# EAGLE design wander-compass-upside-down (EAGLE 9.3.2)
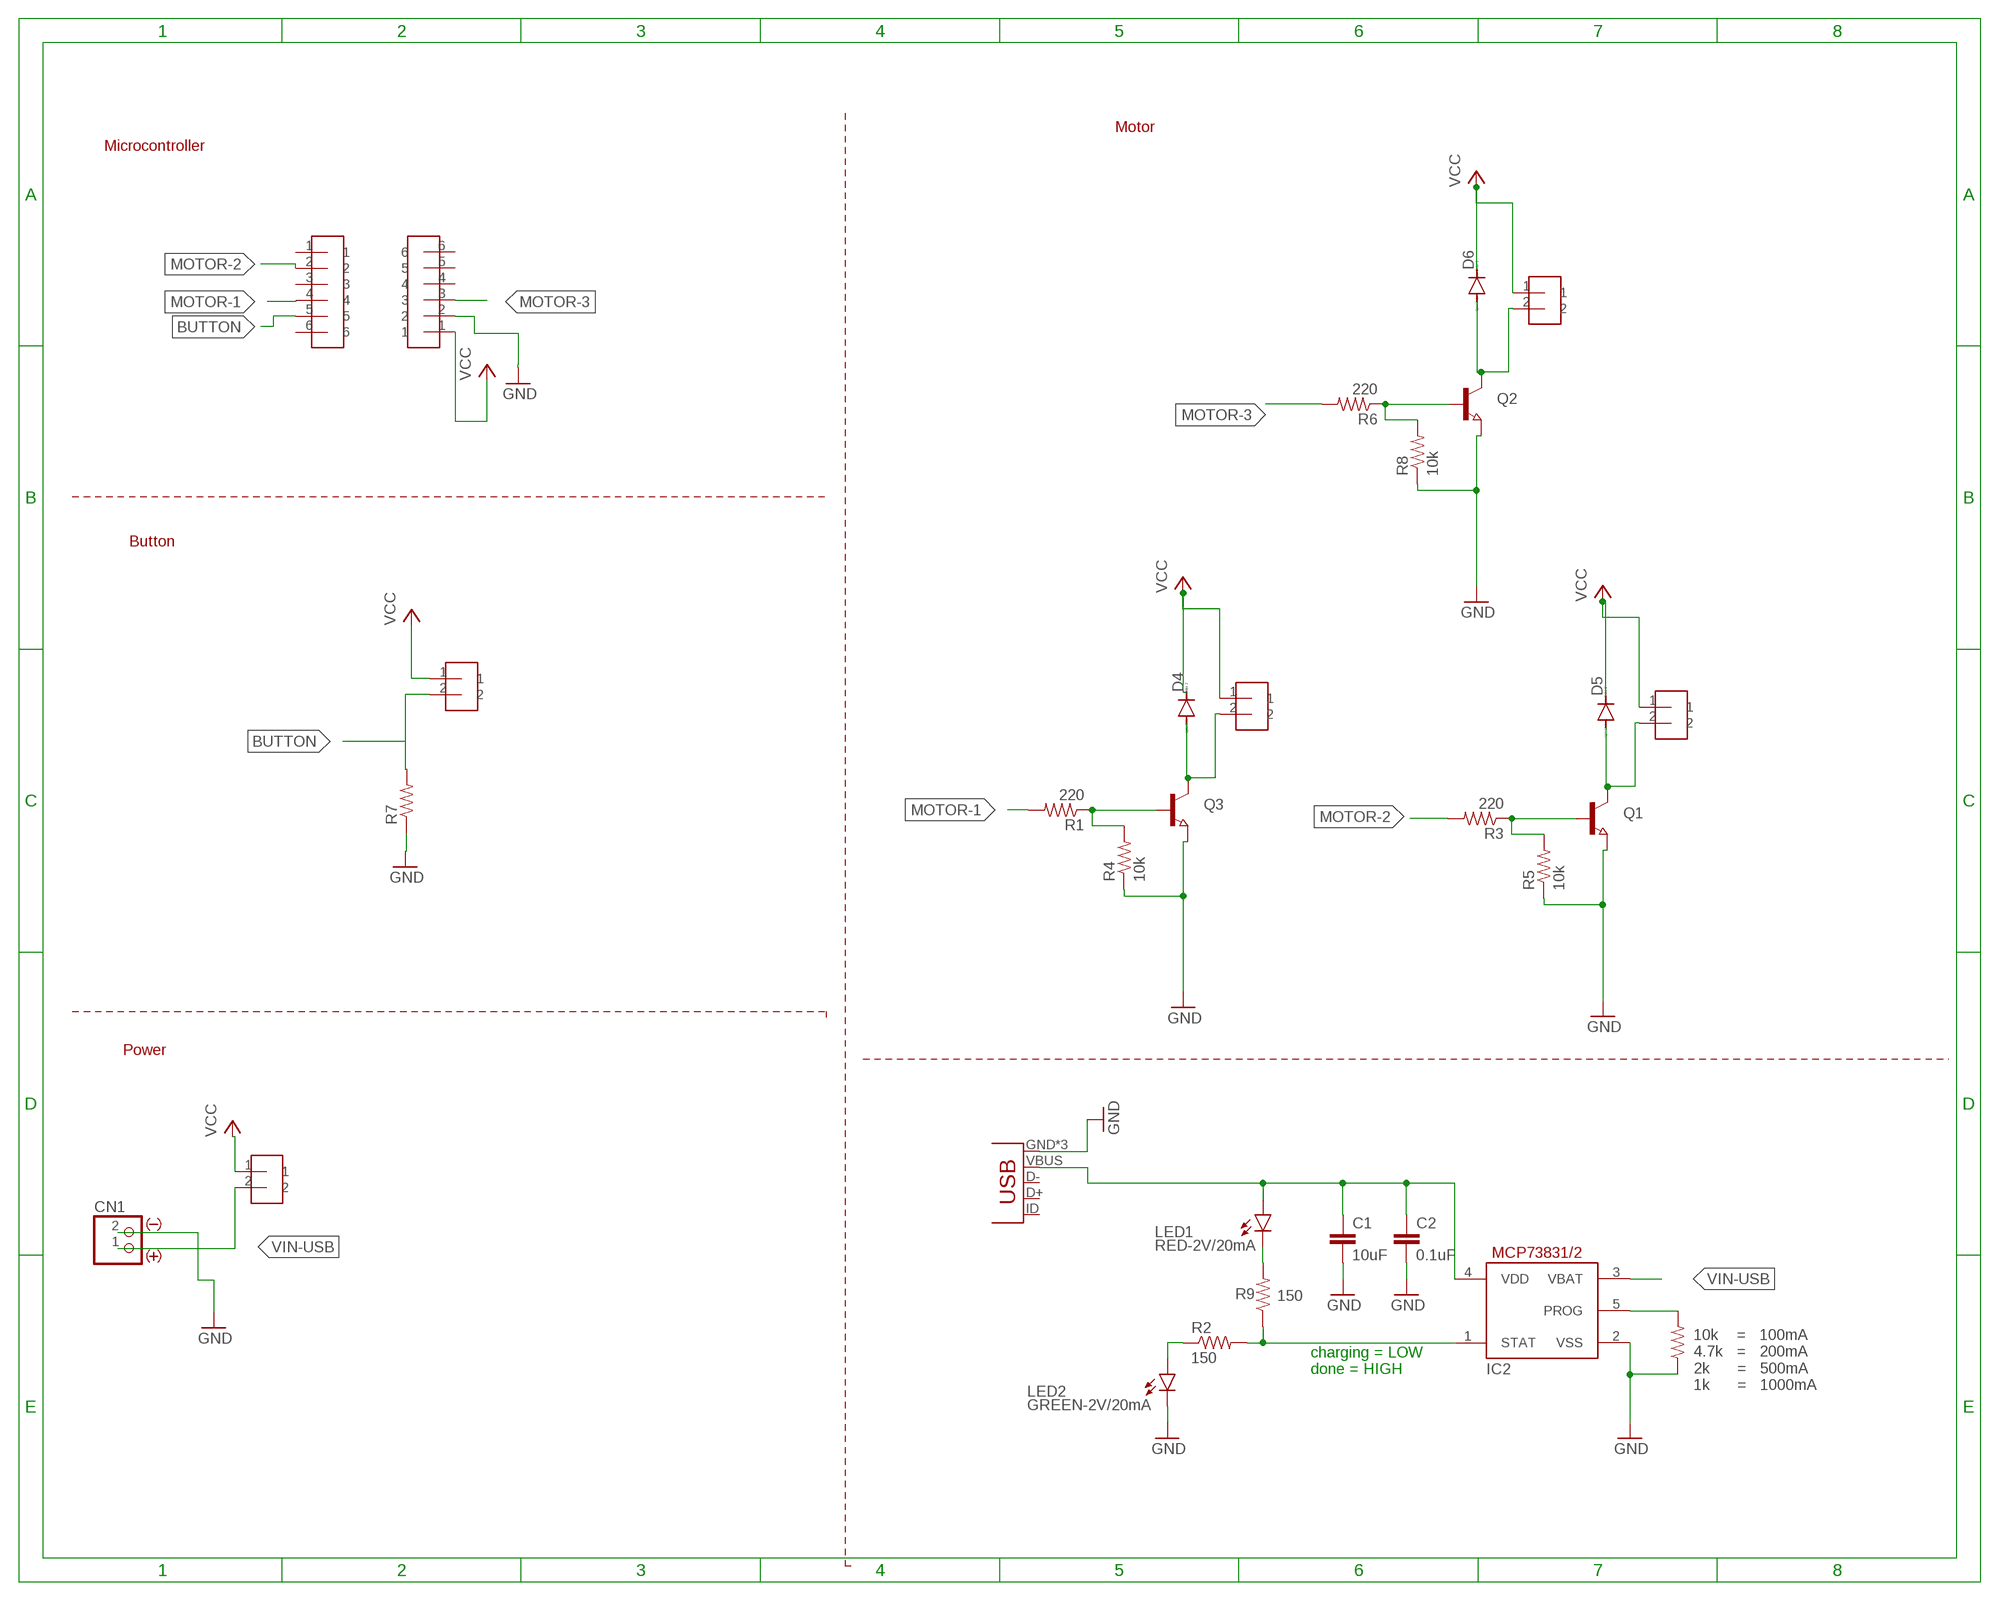
[diagram p0: schematic, sheet 1]

## Parts
C1  10uF  CAP-0805  [0805]
C2  0.1uF  CAP-0805  [0805]
CN1  JST_2PIN_BATTERY-SMT-HORIZ  [JST-PH-2-SMT-RA]
D4  DIODE-SOD523  [SOD523]
D5  DIODE-SOD523  [SOD523]
D6  DIODE-SOD523  [SOD523]
IC2  LIPO_CHARGER/OT  [SOT23-5L]
JP1  USB_CONN-10118192-0001LF  [USB-MICROB]
LED1  RED-2V/20mA  LED-0805  [CHIP-LED0805]
LED2  GREEN-2V/20mA  LED-0805  [CHIP-LED0805]
MOTOR-CENTER-HEADER  HEADER-2  [HEADER-2]
MOTOR-RIGHT-HEADER  HEADER-2  [HEADER-2]
MOTOR_LEFT_HEADER  HEADER-2  [HEADER-2]
Q1  TRANSISTOR-NPN-SOT23  [SOT23]
Q2  TRANSISTOR-NPN-SOT23  [SOT23]
Q3  TRANSISTOR-NPN-SOT23  [SOT23]
R1  220  RESISTOR0603  [0603-RES]
R2  150  RESISTOR-0805  [0805]
R3  220  RESISTOR0603  [0603-RES]
R4  10k  RESISTOR0603  [0603-RES]
R5  10k  RESISTOR0603  [0603-RES]
R6  220  RESISTOR0603  [0603-RES]
R7  RESISTOR0603  [0603-RES]
R8  10k  RESISTOR0603  [0603-RES]
R9  150  RESISTOR-0805  [0805]
R10  2k  RESISTOR-0805  [0805]
U$1  HEADER-2  [HEADER-2]
U$5  HEADER-6  [HEADER-6]
U$6  HEADER-6  [HEADER-6]
U$7  HEADER-2  [HEADER-2]

## Nets
5V: C1.1 C2.1 IC2.4(VDD) JP1.VBUS LED1.A
BUTTON: R7.2 U$1.2 U$6.5
CURRENT-CONTROL: IC2.5(PROG) R10.2
GND: C1.2 C2.2 CN1.2 IC2.2(VSS) JP1.GND JP1.MT1(GND) JP1.MT2(GND) LED2.C Q1.2(E) Q2.2(E) Q3.2(E) R4.1 R5.1 R7.1 R8.1 R10.1 U$5.2
MOTOR-1: R1.2 U$6.4
MOTOR-2: R3.2 U$6.2
MOTOR-3: R6.2 U$5.3
N$1: D4.A MOTOR_LEFT_HEADER.2 Q3.3(C)
N$2: Q1.1(B) R3.1 R5.2
N$3: D5.A MOTOR-CENTER-HEADER.2 Q1.3(C)
N$4: Q3.1(B) R1.1 R4.2
N$5: Q2.1(B) R6.1 R8.2
N$6: D6.A MOTOR-RIGHT-HEADER.2 Q2.3(C)
N$8: LED1.C R9.2
N$9: LED2.A R2.1
STATUS: IC2.1(STAT) R2.2 R9.1
VCC: D4.C D5.C D6.C MOTOR-CENTER-HEADER.1 MOTOR-RIGHT-HEADER.1 MOTOR_LEFT_HEADER.1 U$1.1 U$5.1 U$7.1
VIN-USB: CN1.1 IC2.3(VBAT) U$7.2
Unconnected: JP1.D+ JP1.D- JP1.ID(SHIELD) U$5.4 U$5.5 U$5.6 U$6.1 U$6.3 U$6.6

## Notes on the sheet
- Motor
- Microcontroller
- Button
- Power
- charging = LOW
  done = HIGH
- 10k    =   100mA
  4.7k   =   200mA
  2k      =   500mA
  1k      =   1000mA

## Library data of the parts
C1 C2 = homemade-hardware:CAP: Capacitor Standard 0603 ceramic capacitor, and 0.1" leaded capacitor.
CN1 = homemade-hardware:JST_2PIN_BATTERY: JST 2-Pin Connectors of various flavors SMT-HORIZ (S2B-PH-SM4) SMT-VERT (B2B-PH-SM4) DIP-HORIZ (S2B-PH) DIP-VERT (B2B-PH)
D4-D6 = diode:DIODE-: DIODE
IC2 = homemade-hardware:LIPO_CHARGER: MCP73831/2 <https://www.digikey.com/product-detail/en/microchip-technology/MCP73831T-2ATI-OT/MCP73831T-2ATI-OTCT-ND/1979803>: LiPo Battery Charger
JP1 = homemade-hardware:USB_CONN: 1-1734346-1 <https://www.digikey.com/product-detail/en/te-connectivity-amp-connectors/1-1734346-1/A110862CT-ND/4142246>: USB-B Female Receptacle 10118192-0001LF <https://www.digikey.com/products/en/connectors-interconnects/usb-dvi-hdmi-connectors/312?k=10118192-0001lf&k=&pkeyword=10118192-0001lf&sv=0&pv7=2&sf=0&quantity=&ColumnSort=0&page=1&pageSize=25>: USB-Micro Receptacle; PROD_ID: CONN-09505
LED1 LED2 = homemade-hardware:LED: LEDs Standard schematic elements and footprints for 5mm, 3mm, 1206, and 0603 sized LEDs. 5mm - Spark Fun Electronics SKU : COM-00529 (and others)
MOTOR-CENTER-HEADER MOTOR-RIGHT-HEADER MOTOR_LEFT_HEADER U$1 U$7 = homemade-hardware:HEADER-2
Q1-Q3 = homemade-hardware:TRANSISTOR-NPN: NPN Transistor BJT <https://www.digikey.com/product-detail/en/micro-commercial-co/MMBT2222A-TP/MMBT2222ATPMSCT-ND/717394>: MMBT2222A
R1-R10 = homemade-hardware:RESISTOR: Resistor Basic schematic elements and footprints for 0603, 1206, and PTH resistors.
U$5 U$6 = homemade-hardware:HEADER-6

## Board
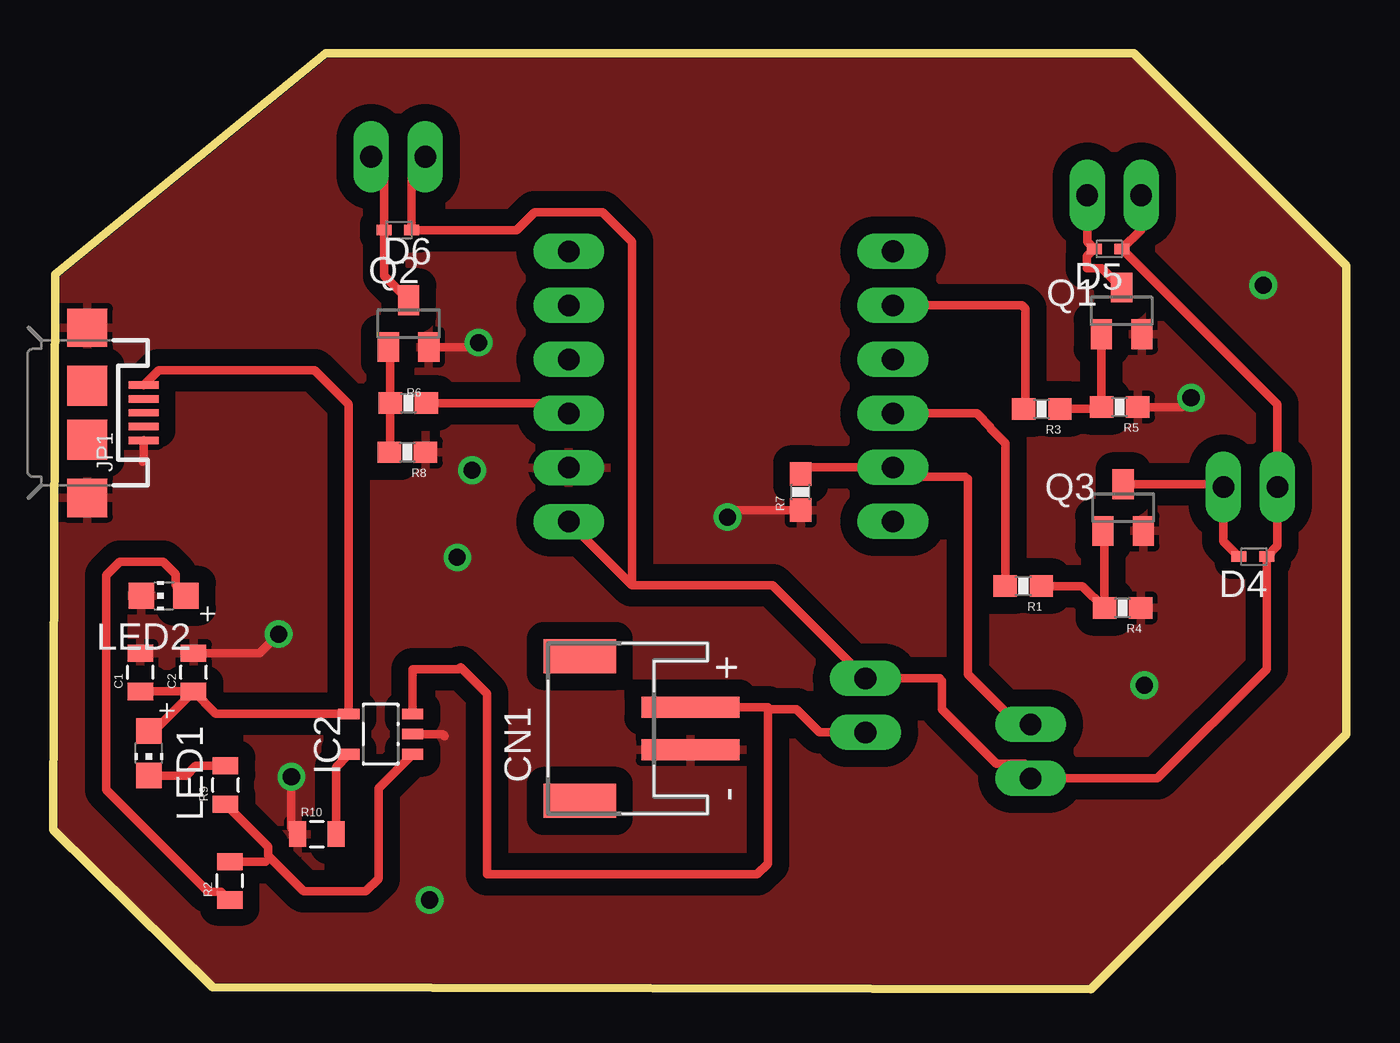
[diagram p1: board, top side]
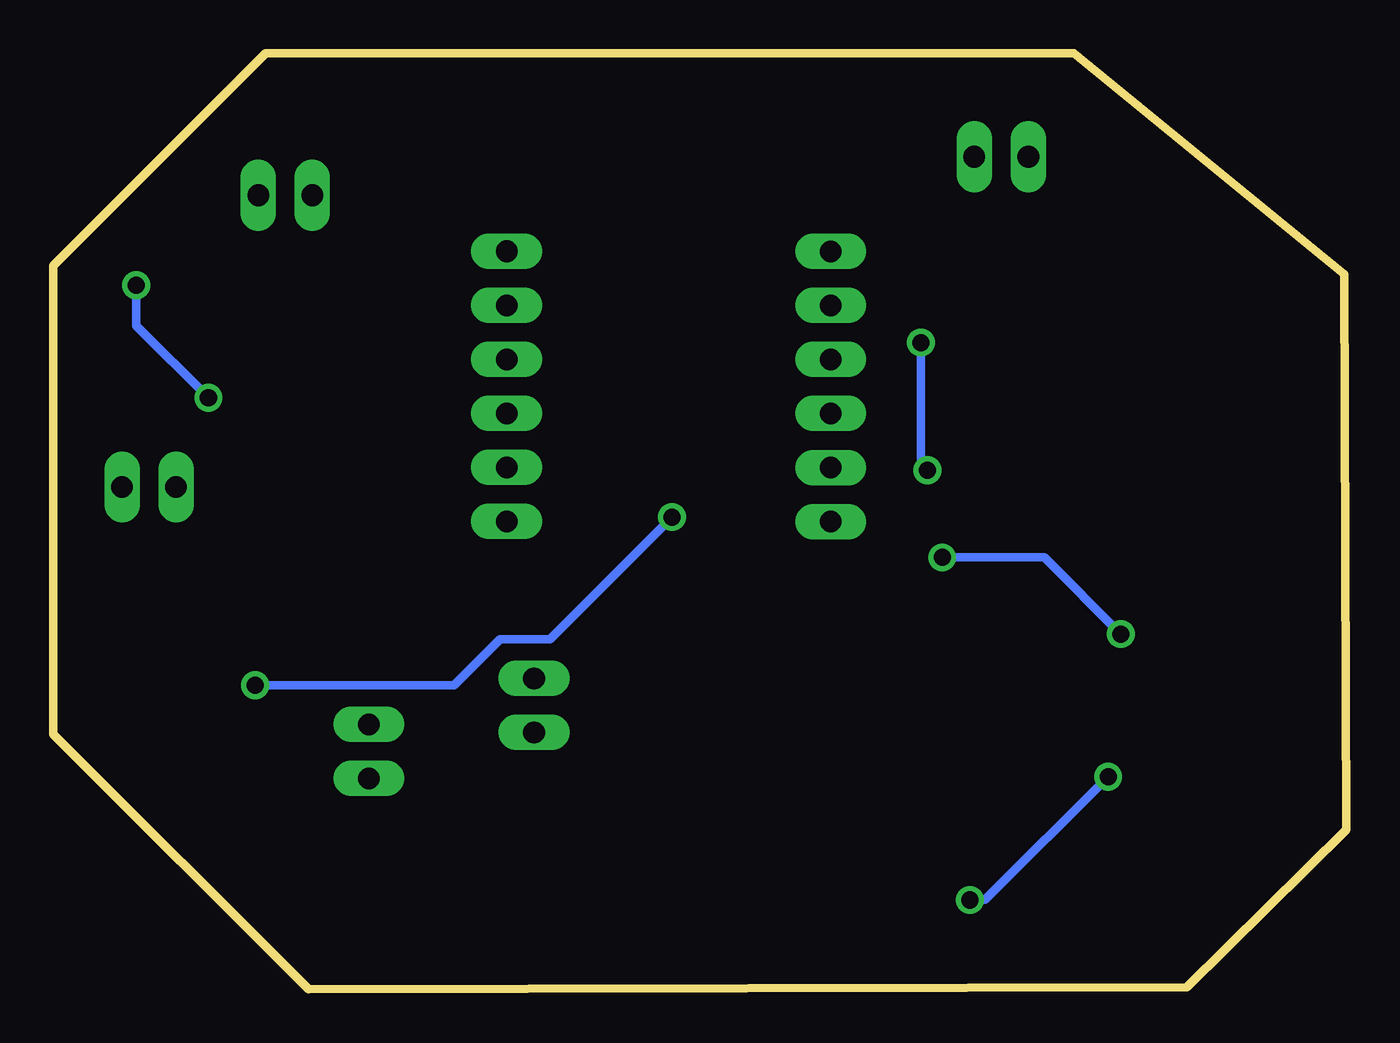
[diagram p2: board, bottom side, seen from below]

Size 60.8 x 44 mm. Coordinates in mm from the lower left corner, seen from the top.
Outline: 0.1,33.6 0,7.5 7.5,0.1 48.8,0 60.8,12 60.8,34 50.8,44 12.8,44 0.1,33.6
Copper layers (1*16): Top 0.035mm / dielectric 1.5mm / Bottom 0.035mm
Design rules "default": minimum track width 16mil, minimum drill 0.8mm, track to track 0.8mm, track to pad 0.8mm, pad to pad 0.8mm, via to via 0.8mm, smd to smd 0mil, copper to edge 1mil, drill to drill 1mil, minimum pad ring 10mil, minimum via ring 10mil, stop-mask expansion 1mil, vias tented up to drill 30mil, thermal gap 10mil

### Footprints (pad centres in the part's own frame; a part is rotated, then mirrored left to right if it is on the bottom)
0805 = smd 0.8 x 1.2: 1 -0.9,0; 2 0.9,0
JST-PH-2-SMT-RA = smd 1 x 4.6: 1 1,-3.7; 2 -1,-3.7 | smd 1.6 x 3.4: NC1 -3.4,1.5; NC2 3.4,1.5
SOD523 = smd 0.7 x 0.5: A 0.7,0; C -0.6,0
SOT23-5L = smd 0.5 x 1: 1 -0.95,-1.5; 2 0,-1.5; 3 0.95,-1.5; 4 0.95,1.5; 5 -0.95,1.5
USB-MICROB = smd 0.35 x 1.4: D+ 0,2.65; D- -0.65,2.65; GND 1.3,2.65; ID 0.65,2.65; VBUS -1.3,2.65 | smd 1.8 x 1.9: MT1 -4,0; MT2 4,0 | smd 1.9 x 1.9: P$1 -1.27,0; P$2 1.27,0
CHIP-LED0805 = smd 1.2 x 1.2: A 0,-1.05; C 0,1.05
HEADER-2 = drill 1.016 pad 1.676 long: 1 0,0; 2 0,2.54
SOT23 = smd 1 x 1.4: 1 -0.95,-1.1; 2 0.95,-1.1; 3 0,1.1
0603-RES = smd 1.1 x 1: 1 -0.85,0; 2 0.85,0
HEADER-6 = drill 1.016 pad 1.676 long: 1 0,0; 2 0,2.54; 3 0,5.08; 4 0,7.62; 5 0,10.16; 6 0,12.7

### Placement (x,y rotation side)
C1  4.1,14.9 90 top
C2  6.6,14.9 90 top
CN1  26.26,12.26 90 top
D4  56.45,20.34 180 top
D5  49.65,34.8 180 top
D6  16.26,35.68 180 top
IC2  15.4,12 90 top
JP1  1.6,27.1 270 top
LED1  4.5,11.1 180 top
LED2  5.2,18.5 90 top
MOTOR-CENTER-HEADER  51.15,37.32 90 top
MOTOR-RIGHT-HEADER  17.49,39.13 90 top
MOTOR_LEFT_HEADER  57.56,23.61 90 top
Q1  50.23,31.89 0 top
Q2  16.71,31.29 0 top
Q3  50.3,22.64 0 top
R1  45.61,18.96 180 top
R2  8.3,5.1 90 top
R3  46.48,27.28 180 top
R4  50.28,17.93 180 top
R5  50.14,27.37 180 top
R6  16.7,27.55 0 top
R7  35.15,23.37 90 top
R8  16.66,25.24 180 top
R9  8.1,9.6 90 top
R10  12.4,7.3 0 top
U$1  45.96,9.91 0 top
U$5  24.24,21.99 0 top
U$6  39.48,34.69 180 top
U$7  38.19,14.62 180 top

### Tracks (layer width: path | path; a pad name or v marks a point on that pad's centre or on a via)
5V
  Top 0.406: 6.8,14.2 C2.1 | C2.1 C1.1 | C2.1 4.75,12.15 LED1.A | C2.1 7.65,12.95 IC2.4 13.9,27.5 12.3,29.1 4.95,29.1 JP1.VBUS
BUTTON
  Top 0.406: R7.2 35.45,24.53 U$6.5 39.91,24.1 42.9,24.1 43,24 43,14.8 45.35,12.45 U$1.2
CURRENT-CONTROL
  Top 0.406: 13.85,11 IC2.5 13.3,10.45 R10.2
GND  (via drill 0.8)
  Top 0.406: C2.2 9.7,15.8 v10.6,16.7 | IC2.2 18.3,12 18.4,11.9 | R10.1 11.2,7.6 v11.2,10 | R7.1 32.02,22.52 v31.7,22.2 | R5.1 53.07,27.37 v53.5,27.8 | JP1.GND 4.25,24.85 4.2,24.8 | Q2.2 19.79,30.19 v20,30.4
  Bottom 0.406: v10.6,16.7 14.2,20.3 v19,20.3 | v11.2,10 17,4.2 v17.7,4.2 | v31.7,22.2 37.44,16.46 39.79,16.46 41.95,14.3 v51.3,14.3 | v53.5,27.8 56.9,31.2 v56.9,33.1 | v20,30.4 20,24.7 v19.7,24.4
  pour Top: -3.2,50 -3.2,-6 68.8,-6 68.8,50
MOTOR-1
  Top 0.406: U$6.4 43.43,27.07 44.08,26.42 44.08,26.37 44.76,25.68 R1.2
MOTOR-2
  Top 0.406: U$6.2 45.55,32.15 45.7,32 45.7,27.35 R3.2
MOTOR-3
  Top 0.406: 17.4,27.7 R6.2 23.75,27.55 U$5.3
N$1
  Top 0.406: Q3.3 54.89,23.74 MOTOR_LEFT_HEADER.2 55.02,21.07 D4.A
N$2
  Top 0.406: R3.1 49.2,27.28 R5.2 Q1.1
N$3
  Top 0.406: Q1.3 49.32,33.9 48.6,33.9 48.6,34.45 D5.A 48.61,35.14 MOTOR-CENTER-HEADER.2
N$4
  Top 0.406: Q3.1 49.43,21.47 R4.2 48.4,18.96 R1.1
N$5
  Top 0.406: 15.64,30.07 Q2.1 15.85,30.1 R6.1 | 15.96,25.39 R8.2 15.85,25.28 R6.1 | R6.1 15.81,27.6
N$6
  Top 0.406: MOTOR-RIGHT-HEADER.2 15.56,38.52 D6.A 15.56,33.54 Q2.3
N$8
  Top 0.406: 7.9,10.7 R9.2 6.7,10.5 6.25,10.05 LED1.C
N$9
  Top 0.406: R2.1 7.9,4.6 7.28,4.6 2.5,9.38 2.5,19.47 3.13,20.1 5.17,20.1 5.75,19.52 5.75,19 LED2.A
STATUS
  Top 0.406: IC2.1 15.3,9.45 15.3,5.2 14.7,4.6 11.78,4.6 10.19,6.19 | R9.1 10.1,6.7 10.1,6.28 10.19,6.19 | R2.2 10,6 10.19,6.19
VCC
  Top 0.406: MOTOR-CENTER-HEADER.1 51.15,35.7 D5.C 57.56,27.49 MOTOR_LEFT_HEADER.1 57.56,20.85 D4.C 57.05,15.05 51.91,9.91 U$1.1 45.96,10.34 45.68,10.61 44.36,10.61 41.79,13.17 41.79,14.51 41.68,14.62 U$7.1 33.81,19 27.23,19 | U$5.1 27.23,19 | MOTOR-RIGHT-HEADER.1 16.86,38.5 D6.C 21.79,35.68 22.64,36.53 25.84,36.53 27.23,35.14 27.23,19
VIN-USB
  Top 0.406: U$7.2 36.02,12.08 34.94,13.16 33.6,13.16 | CN1.1 33.6,13.26 33.6,13.16 | 33.6,13.16 33.6,5.9 33.1,5.4 20.4,5.4 20.4,13.9 19.15,15.15 19.05,15.05 16.9,15.05 IC2.3